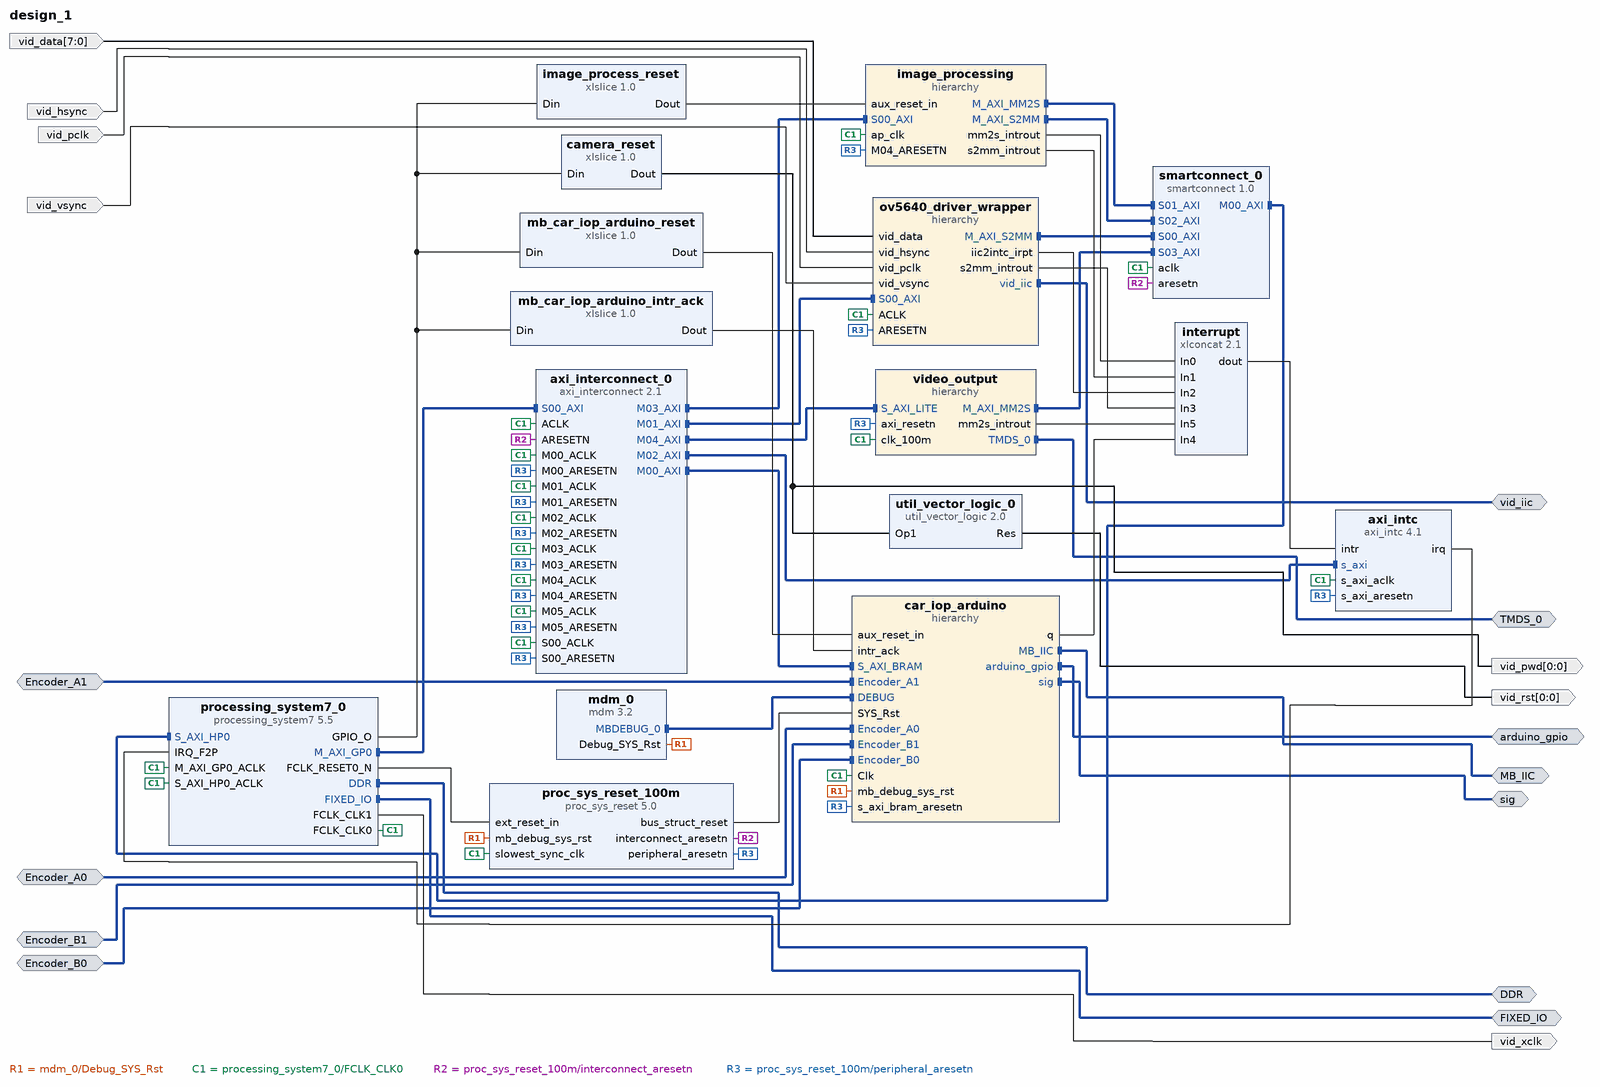
[diagram p0: block diagram of the top level]
# Vivado block design design_1, xc7z020clg400-1, Vivado 2018.3
create_bd_design design_1

create_bd_intf_port -mode Master -vlnv xilinx.com:interface:ddrx_rtl:1.0 DDR
create_bd_intf_port -mode Slave -vlnv xilinx.com:interface:diff_analog_io_rtl:1.0 Encoder_A0
create_bd_intf_port -mode Slave -vlnv xilinx.com:interface:diff_analog_io_rtl:1.0 Encoder_A1
create_bd_intf_port -mode Slave -vlnv xilinx.com:interface:diff_analog_io_rtl:1.0 Encoder_B0
create_bd_intf_port -mode Slave -vlnv xilinx.com:interface:diff_analog_io_rtl:1.0 Encoder_B1
create_bd_intf_port -mode Master -vlnv xilinx.com:display_processing_system7:fixedio_rtl:1.0 FIXED_IO
create_bd_intf_port -mode Master -vlnv xilinx.com:interface:iic_rtl:1.0 MB_IIC
create_bd_intf_port -mode Master -vlnv digilentinc.com:interface:tmds_rtl:1.0 TMDS_0
create_bd_intf_port -mode Master -vlnv xilinx.com:interface:gpio_rtl:1.0 arduino_gpio
create_bd_intf_port -mode Master -vlnv xilinx.com:interface:gpio_rtl:1.0 sig
create_bd_intf_port -mode Master -vlnv xilinx.com:interface:iic_rtl:1.0 vid_iic
create_bd_port -dir I -from 7 -to 0 vid_data
create_bd_port -dir I vid_hsync
create_bd_port -dir I -type clk vid_pclk
set_property -dict {CONFIG.FREQ_HZ 74250000} [get_bd_ports vid_pclk]
create_bd_port -dir O -from 0 -to 0 vid_pwd
create_bd_port -dir O -from 0 -to 0 vid_rst
create_bd_port -dir I vid_vsync
create_bd_port -dir O -type clk vid_xclk
set_property -dict {CONFIG.FREQ_HZ 23809525} [get_bd_ports vid_xclk]

create_bd_cell -type ip -vlnv xilinx.com:ip:axi_intc:4.1 axi_intc
create_bd_cell -type ip -vlnv xilinx.com:ip:axi_interconnect:2.1 axi_interconnect_0
set_property -dict {CONFIG.NUM_MI 6 CONFIG.NUM_SI 1} [get_bd_cells axi_interconnect_0]
create_bd_cell -type ip -vlnv xilinx.com:ip:xlslice:1.0 camera_reset
set_property -dict {CONFIG.DIN_FROM 3 CONFIG.DIN_TO 3 CONFIG.DIN_WIDTH 5 CONFIG.DOUT_WIDTH 1} [get_bd_cells camera_reset]
create_bd_cell -type hier car_iop_arduino
create_bd_cell -type ip -vlnv xilinx.com:ip:xlslice:1.0 image_process_reset
set_property -dict {CONFIG.DIN_FROM 2 CONFIG.DIN_TO 2 CONFIG.DIN_WIDTH 5 CONFIG.DOUT_WIDTH 1} [get_bd_cells image_process_reset]
create_bd_cell -type hier image_processing
create_bd_cell -type ip -vlnv xilinx.com:ip:xlconcat:2.1 interrupt
set_property -dict {CONFIG.NUM_PORTS 7} [get_bd_cells interrupt]
create_bd_cell -type ip -vlnv xilinx.com:ip:xlslice:1.0 mb_car_iop_arduino_intr_ack
set_property -dict [list \
  CONFIG.DIN_FROM 1 \
  CONFIG.DIN_TO 1 \
  CONFIG.DIN_WIDTH 5 \
  CONFIG.DOUT_WIDTH 1 \
] [get_bd_cells mb_car_iop_arduino_intr_ack]
create_bd_cell -type ip -vlnv xilinx.com:ip:xlslice:1.0 mb_car_iop_arduino_reset
set_property -dict {CONFIG.DIN_FROM 0 CONFIG.DIN_TO 0 CONFIG.DIN_WIDTH 5} [get_bd_cells mb_car_iop_arduino_reset]
create_bd_cell -type ip -vlnv xilinx.com:ip:mdm:3.2 mdm_0
set_property -dict {CONFIG.C_ADDR_SIZE 32 CONFIG.C_MB_DBG_PORTS 1 CONFIG.C_M_AXI_ADDR_WIDTH 32} [get_bd_cells mdm_0]
create_bd_cell -type hier ov5640_driver_wrapper
create_bd_cell -type ip -vlnv xilinx.com:ip:proc_sys_reset:5.0 proc_sys_reset_100m
create_bd_cell -type ip -vlnv xilinx.com:ip:processing_system7:5.5 processing_system7_0
set_property -dict [list \
  CONFIG.PCW_APU_PERIPHERAL_FREQMHZ 650 \
  CONFIG.PCW_CRYSTAL_PERIPHERAL_FREQMHZ 50 \
  CONFIG.PCW_ENET0_ENET0_IO {MIO 16 .. 27} \
  CONFIG.PCW_ENET0_GRP_MDIO_ENABLE 1 \
  CONFIG.PCW_ENET0_GRP_MDIO_IO {MIO 52 .. 53} \
  CONFIG.PCW_ENET0_PERIPHERAL_ENABLE 1 \
  CONFIG.PCW_ENET0_RESET_ENABLE 1 \
  CONFIG.PCW_ENET0_RESET_IO {MIO 9} \
  CONFIG.PCW_ENET_RESET_ENABLE 1 \
  CONFIG.PCW_ENET_RESET_SELECT {Share reset pin} \
  CONFIG.PCW_EN_CLK1_PORT 1 \
  CONFIG.PCW_EN_CLK2_PORT 1 \
  CONFIG.PCW_FPGA0_PERIPHERAL_FREQMHZ 100 \
  CONFIG.PCW_FPGA1_PERIPHERAL_FREQMHZ 24 \
  CONFIG.PCW_FPGA2_PERIPHERAL_FREQMHZ 10 \
  CONFIG.PCW_FPGA_FCLK1_ENABLE 1 \
  CONFIG.PCW_FPGA_FCLK2_ENABLE 1 \
  CONFIG.PCW_GPIO_EMIO_GPIO_ENABLE 1 \
  CONFIG.PCW_GPIO_EMIO_GPIO_IO 5 \
  CONFIG.PCW_GPIO_EMIO_GPIO_WIDTH 5 \
  CONFIG.PCW_GPIO_MIO_GPIO_ENABLE 1 \
  CONFIG.PCW_GPIO_MIO_GPIO_IO MIO \
  CONFIG.PCW_I2C_RESET_ENABLE 1 \
  CONFIG.PCW_IRQ_F2P_INTR 1 \
  CONFIG.PCW_PERIPHERAL_BOARD_PRESET part0 \
  CONFIG.PCW_PRESET_BANK1_VOLTAGE {LVCMOS 1.8V} \
  CONFIG.PCW_QSPI_GRP_FBCLK_ENABLE 1 \
  CONFIG.PCW_QSPI_GRP_FBCLK_IO {MIO 8} \
  CONFIG.PCW_QSPI_GRP_SINGLE_SS_ENABLE 1 \
  CONFIG.PCW_QSPI_GRP_SINGLE_SS_IO {MIO 1 .. 6} \
  CONFIG.PCW_QSPI_PERIPHERAL_ENABLE 1 \
  CONFIG.PCW_QSPI_QSPI_IO {MIO 1 .. 6} \
  CONFIG.PCW_SD0_GRP_CD_ENABLE 1 \
  CONFIG.PCW_SD0_GRP_CD_IO {MIO 47} \
  CONFIG.PCW_SD0_GRP_WP_ENABLE 0 \
  CONFIG.PCW_SD0_PERIPHERAL_ENABLE 1 \
  CONFIG.PCW_SD0_SD0_IO {MIO 40 .. 45} \
  CONFIG.PCW_SDIO_PERIPHERAL_FREQMHZ 50 \
  CONFIG.PCW_SINGLE_QSPI_DATA_MODE x4 \
  CONFIG.PCW_UART0_PERIPHERAL_ENABLE 1 \
  CONFIG.PCW_UART0_UART0_IO {MIO 14 .. 15} \
  CONFIG.PCW_UART1_PERIPHERAL_ENABLE 0 \
  CONFIG.PCW_UART_PERIPHERAL_FREQMHZ 100 \
  CONFIG.PCW_UIPARAM_DDR_BUS_WIDTH {16 Bit} \
  CONFIG.PCW_UIPARAM_DDR_FREQ_MHZ 525 \
  CONFIG.PCW_UIPARAM_DDR_PARTNO {MT41J256M16 RE-125} \
  CONFIG.PCW_USB0_PERIPHERAL_ENABLE 1 \
  CONFIG.PCW_USB0_RESET_ENABLE 1 \
  CONFIG.PCW_USB0_RESET_IO {MIO 46} \
  CONFIG.PCW_USB0_USB0_IO {MIO 28 .. 39} \
  CONFIG.PCW_USB_RESET_ENABLE 1 \
  CONFIG.PCW_USB_RESET_SELECT {Share reset pin} \
  CONFIG.PCW_USE_FABRIC_INTERRUPT 1 \
  CONFIG.PCW_USE_S_AXI_HP0 1 \
] [get_bd_cells processing_system7_0]
# 503 more settings of processing_system7_0 are not shown: defaults, MIO pin electricals, DDR timing, and values the tool derives
create_bd_cell -type ip -vlnv xilinx.com:ip:smartconnect:1.0 smartconnect_0
set_property -dict {CONFIG.NUM_SI 4} [get_bd_cells smartconnect_0]
create_bd_cell -type ip -vlnv xilinx.com:ip:util_vector_logic:2.0 util_vector_logic_0
set_property -dict {CONFIG.C_OPERATION not CONFIG.C_SIZE 1} [get_bd_cells util_vector_logic_0]
create_bd_cell -type hier video_output

# ---- hierarchy /car_iop_arduino ----
current_bd_instance /car_iop_arduino
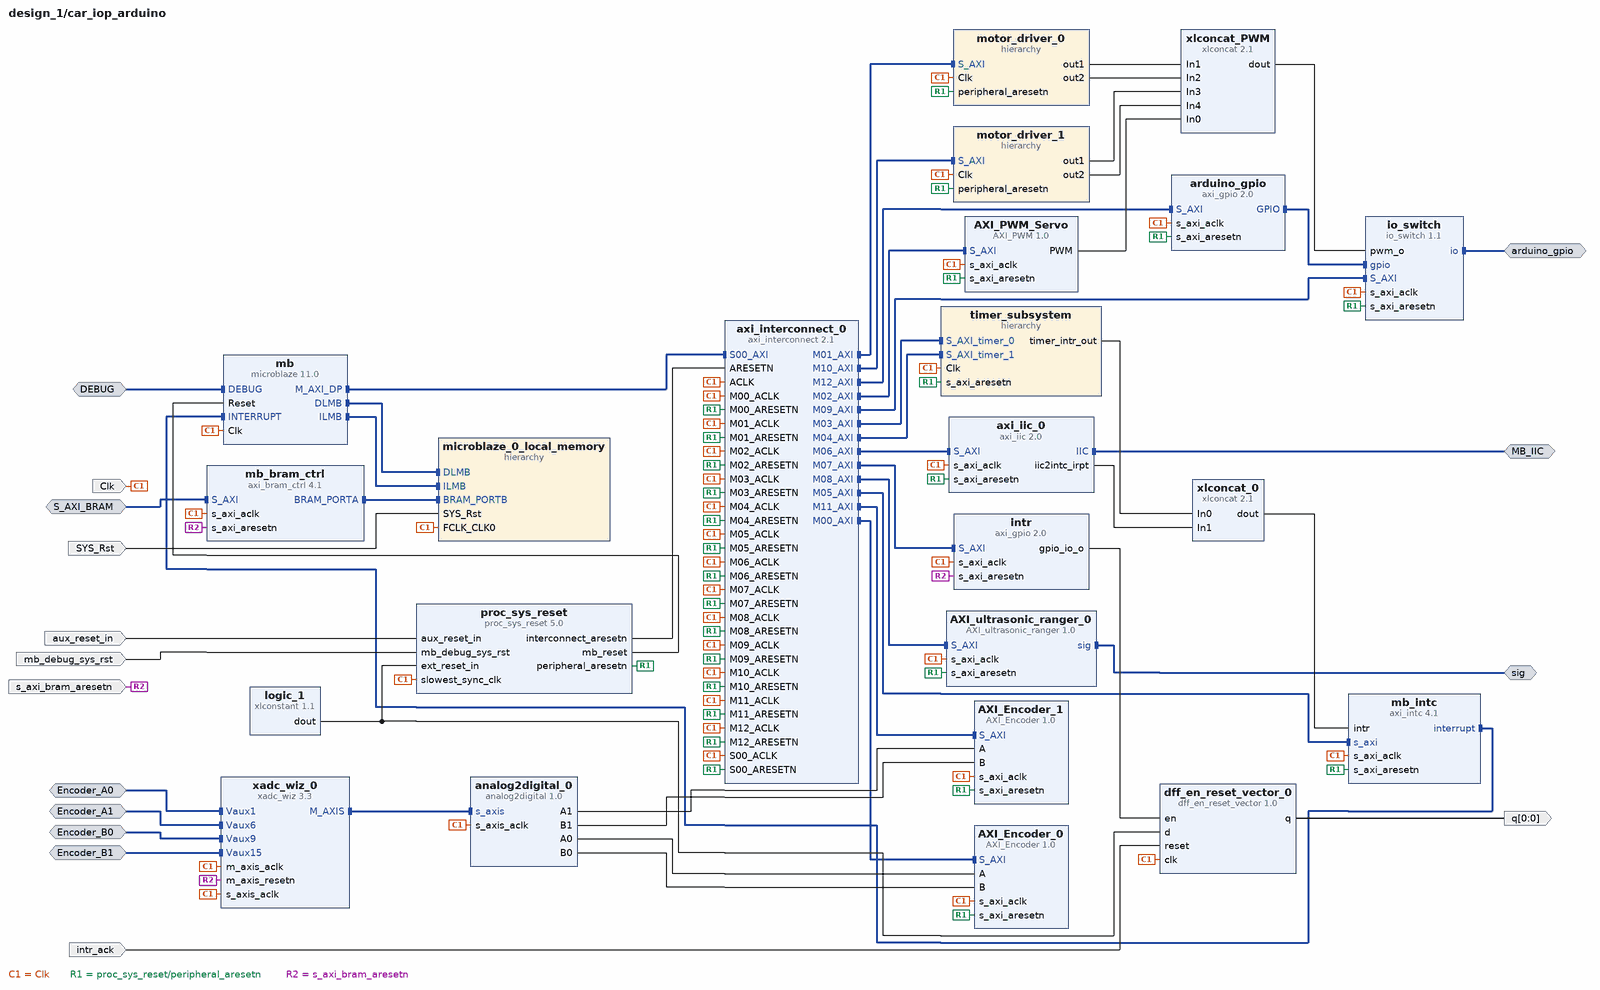
[diagram p1: block diagram inside /car_iop_arduino]
create_bd_intf_pin -mode Slave -vlnv xilinx.com:interface:mbdebug_rtl:3.0 DEBUG
create_bd_intf_pin -mode Slave -vlnv xilinx.com:interface:diff_analog_io_rtl:1.0 Encoder_A0
create_bd_intf_pin -mode Slave -vlnv xilinx.com:interface:diff_analog_io_rtl:1.0 Encoder_A1
create_bd_intf_pin -mode Slave -vlnv xilinx.com:interface:diff_analog_io_rtl:1.0 Encoder_B0
create_bd_intf_pin -mode Slave -vlnv xilinx.com:interface:diff_analog_io_rtl:1.0 Encoder_B1
create_bd_intf_pin -mode Master -vlnv xilinx.com:interface:iic_rtl:1.0 MB_IIC
create_bd_intf_pin -mode Slave -vlnv xilinx.com:interface:aximm_rtl:1.0 S_AXI_BRAM
create_bd_intf_pin -mode Master -vlnv xilinx.com:interface:gpio_rtl:1.0 arduino_gpio
create_bd_intf_pin -mode Master -vlnv xilinx.com:interface:gpio_rtl:1.0 sig
create_bd_pin -dir I -type clk Clk
create_bd_pin -dir I -type rst SYS_Rst
create_bd_pin -dir I -type rst aux_reset_in
create_bd_pin -dir I intr_ack
create_bd_pin -dir I -type rst mb_debug_sys_rst
create_bd_pin -dir O -from 0 -to 0 q
create_bd_pin -dir I -type rst s_axi_bram_aresetn

create_bd_cell -type ip -vlnv xilinx.com:user:AXI_Encoder:1.0 AXI_Encoder_0
create_bd_cell -type ip -vlnv xilinx.com:user:AXI_Encoder:1.0 AXI_Encoder_1
create_bd_cell -type ip -vlnv xilinx.com:user:AXI_PWM:1.0 AXI_PWM_Servo
create_bd_cell -type ip -vlnv xilinx.com:user:AXI_ultrasonic_ranger:1.0 AXI_ultrasonic_ranger_0
set_property -dict {CONFIG.PULSE_WIDTH_US 10} [get_bd_cells AXI_ultrasonic_ranger_0]
create_bd_cell -type ip -vlnv xilinx.com:user:analog2digital:1.0 analog2digital_0
create_bd_cell -type ip -vlnv xilinx.com:ip:axi_gpio:2.0 arduino_gpio
set_property -dict {CONFIG.C_GPIO_WIDTH 15} [get_bd_cells arduino_gpio]
create_bd_cell -type ip -vlnv xilinx.com:ip:axi_iic:2.0 axi_iic_0
create_bd_cell -type ip -vlnv xilinx.com:ip:axi_interconnect:2.1 axi_interconnect_0
set_property -dict {CONFIG.NUM_MI 13} [get_bd_cells axi_interconnect_0]
create_bd_cell -type ip -vlnv xilinx.com:user:dff_en_reset_vector:1.0 dff_en_reset_vector_0
set_property -dict {CONFIG.SIZE 1} [get_bd_cells dff_en_reset_vector_0]
create_bd_cell -type ip -vlnv xilinx.com:ip:axi_gpio:2.0 intr
set_property -dict {CONFIG.C_ALL_OUTPUTS 1 CONFIG.C_GPIO_WIDTH 1} [get_bd_cells intr]
create_bd_cell -type ip -vlnv xilinx.com:user:io_switch:1.1 io_switch
set_property -dict [list \
  CONFIG.C_INTERFACE_TYPE 3 \
  CONFIG.C_IO_SWITCH_WIDTH 13 \
  CONFIG.C_NUM_PWMS 5 \
  CONFIG.I2C0_Enable false \
  CONFIG.PWM_Enable true \
] [get_bd_cells io_switch]
create_bd_cell -type ip -vlnv xilinx.com:ip:xlconstant:1.1 logic_1
create_bd_cell -type ip -vlnv xilinx.com:ip:microblaze:11.0 mb
set_property -dict [list \
  CONFIG.C_ADDR_TAG_BITS 0 \
  CONFIG.C_DCACHE_ADDR_TAG 0 \
  CONFIG.C_DEBUG_ENABLED 1 \
  CONFIG.C_D_AXI 1 \
  CONFIG.C_D_LMB 1 \
  CONFIG.C_ENABLE_DISCRETE_PORTS 0 \
  CONFIG.C_I_AXI 0 \
  CONFIG.C_I_LMB 1 \
  CONFIG.C_USE_BARREL 0 \
  CONFIG.C_USE_DCACHE 0 \
  CONFIG.C_USE_DIV 1 \
  CONFIG.C_USE_FPU 1 \
  CONFIG.C_USE_HW_MUL 1 \
  CONFIG.C_USE_ICACHE 0 \
  CONFIG.C_USE_MMU 0 \
  CONFIG.G_USE_EXCEPTIONS 0 \
] [get_bd_cells mb]
create_bd_cell -type ip -vlnv xilinx.com:ip:axi_bram_ctrl:4.1 mb_bram_ctrl
set_property -dict {CONFIG.PROTOCOL AXI4 CONFIG.SINGLE_PORT_BRAM 1} [get_bd_cells mb_bram_ctrl]
create_bd_cell -type ip -vlnv xilinx.com:ip:axi_intc:4.1 mb_intc
create_bd_cell -type hier microblaze_0_local_memory
create_bd_cell -type hier motor_driver_0
create_bd_cell -type hier motor_driver_1
create_bd_cell -type ip -vlnv xilinx.com:ip:proc_sys_reset:5.0 proc_sys_reset
set_property -dict {CONFIG.C_AUX_RESET_HIGH 1} [get_bd_cells proc_sys_reset]
create_bd_cell -type hier timer_subsystem
create_bd_cell -type ip -vlnv xilinx.com:ip:xadc_wiz:3.3 xadc_wiz_0
set_property -dict [list \
  CONFIG.CHANNEL_ENABLE_VAUXP15_VAUXN15 true \
  CONFIG.CHANNEL_ENABLE_VAUXP1_VAUXN1 true \
  CONFIG.CHANNEL_ENABLE_VAUXP2_VAUXN2 false \
  CONFIG.CHANNEL_ENABLE_VAUXP5_VAUXN5 false \
  CONFIG.CHANNEL_ENABLE_VAUXP6_VAUXN6 true \
  CONFIG.CHANNEL_ENABLE_VAUXP9_VAUXN9 true \
  CONFIG.CHANNEL_ENABLE_VP_VN false \
  CONFIG.ENABLE_AXI4STREAM true \
  CONFIG.ENABLE_RESET false \
  CONFIG.ENABLE_VCCDDRO_ALARM false \
  CONFIG.ENABLE_VCCPAUX_ALARM false \
  CONFIG.ENABLE_VCCPINT_ALARM false \
  CONFIG.EXTERNAL_MUX_CHANNEL VP_VN \
  CONFIG.FIFO_DEPTH 16 \
  CONFIG.INTERFACE_SELECTION None \
  CONFIG.OT_ALARM false \
  CONFIG.SEQUENCER_MODE Continuous \
  CONFIG.SINGLE_CHANNEL_SELECTION TEMPERATURE \
  CONFIG.USER_TEMP_ALARM false \
  CONFIG.VCCAUX_ALARM false \
  CONFIG.VCCINT_ALARM false \
  CONFIG.XADC_STARUP_SELECTION channel_sequencer \
] [get_bd_cells xadc_wiz_0]
create_bd_cell -type ip -vlnv xilinx.com:ip:xlconcat:2.1 xlconcat_0
create_bd_cell -type ip -vlnv xilinx.com:ip:xlconcat:2.1 xlconcat_PWM
set_property -dict {CONFIG.NUM_PORTS 5} [get_bd_cells xlconcat_PWM]

# ---- hierarchy /car_iop_arduino/microblaze_0_local_memory ----
current_bd_instance /car_iop_arduino/microblaze_0_local_memory
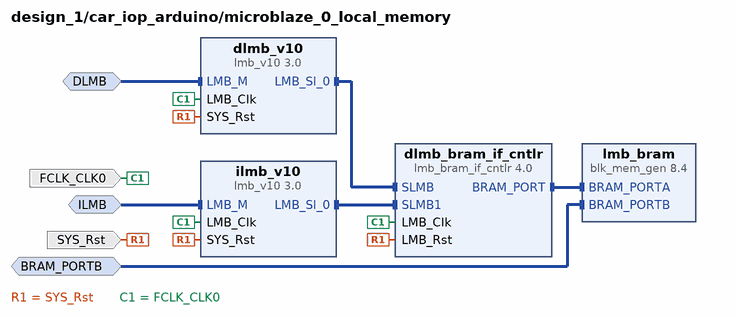
[diagram p2: block diagram inside /car_iop_arduino/microblaze_0_local_memory]
create_bd_intf_pin -mode Slave -vlnv xilinx.com:interface:bram_rtl:1.0 BRAM_PORTB
create_bd_intf_pin -mode MirroredMaster -vlnv xilinx.com:interface:lmb_rtl:1.0 DLMB
create_bd_intf_pin -mode MirroredMaster -vlnv xilinx.com:interface:lmb_rtl:1.0 ILMB
create_bd_pin -dir I -type clk FCLK_CLK0
create_bd_pin -dir I -type rst SYS_Rst

create_bd_cell -type ip -vlnv xilinx.com:ip:lmb_bram_if_cntlr:4.0 dlmb_bram_if_cntlr
set_property -dict {CONFIG.C_ECC 0 CONFIG.C_NUM_LMB 2} [get_bd_cells dlmb_bram_if_cntlr]
create_bd_cell -type ip -vlnv xilinx.com:ip:lmb_v10:3.0 dlmb_v10
create_bd_cell -type ip -vlnv xilinx.com:ip:lmb_v10:3.0 ilmb_v10
create_bd_cell -type ip -vlnv xilinx.com:ip:blk_mem_gen:8.4 lmb_bram
set_property -dict {CONFIG.Memory_Type True_Dual_Port_RAM CONFIG.use_bram_block BRAM_Controller} [get_bd_cells lmb_bram]

# ---- hierarchy /car_iop_arduino/motor_driver_0 ----
current_bd_instance /car_iop_arduino/motor_driver_0
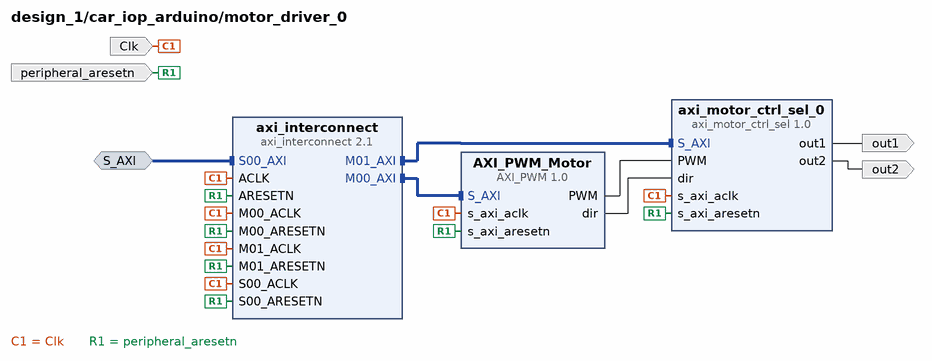
[diagram p3: block diagram inside /car_iop_arduino/motor_driver_0]
create_bd_intf_pin -mode Slave -vlnv xilinx.com:interface:aximm_rtl:1.0 S_AXI
create_bd_pin -dir I -type clk Clk
create_bd_pin -dir O out1
create_bd_pin -dir O out2
create_bd_pin -dir I -type rst peripheral_aresetn

create_bd_cell -type ip -vlnv xilinx.com:user:AXI_PWM:1.0 AXI_PWM_Motor
create_bd_cell -type ip -vlnv xilinx.com:ip:axi_interconnect:2.1 axi_interconnect
create_bd_cell -type ip -vlnv xilinx.com:user:axi_motor_ctrl_sel:1.0 axi_motor_ctrl_sel_0

# ---- hierarchy /car_iop_arduino/motor_driver_1 ----
current_bd_instance /car_iop_arduino/motor_driver_1
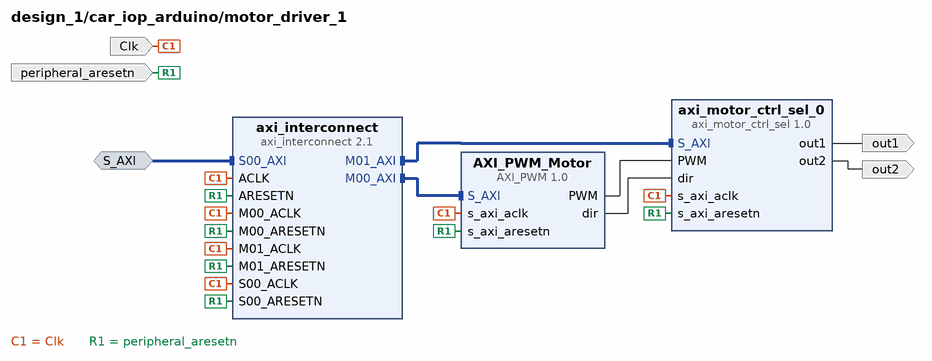
[diagram p4: block diagram inside /car_iop_arduino/motor_driver_1]
create_bd_intf_pin -mode Slave -vlnv xilinx.com:interface:aximm_rtl:1.0 S_AXI
create_bd_pin -dir I -type clk Clk
create_bd_pin -dir O out1
create_bd_pin -dir O out2
create_bd_pin -dir I -type rst peripheral_aresetn

create_bd_cell -type ip -vlnv xilinx.com:user:AXI_PWM:1.0 AXI_PWM_Motor
create_bd_cell -type ip -vlnv xilinx.com:ip:axi_interconnect:2.1 axi_interconnect
create_bd_cell -type ip -vlnv xilinx.com:user:axi_motor_ctrl_sel:1.0 axi_motor_ctrl_sel_0

# ---- hierarchy /car_iop_arduino/timer_subsystem ----
current_bd_instance /car_iop_arduino/timer_subsystem
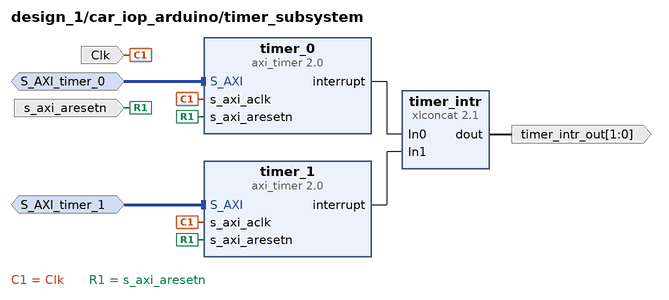
[diagram p5: block diagram inside /car_iop_arduino/timer_subsystem]
create_bd_intf_pin -mode Slave -vlnv xilinx.com:interface:aximm_rtl:1.0 S_AXI_timer_0
create_bd_intf_pin -mode Slave -vlnv xilinx.com:interface:aximm_rtl:1.0 S_AXI_timer_1
create_bd_pin -dir I -type clk Clk
create_bd_pin -dir I -type rst s_axi_aresetn
create_bd_pin -dir O -from 1 -to 0 timer_intr_out

create_bd_cell -type ip -vlnv xilinx.com:ip:axi_timer:2.0 timer_0
create_bd_cell -type ip -vlnv xilinx.com:ip:axi_timer:2.0 timer_1
create_bd_cell -type ip -vlnv xilinx.com:ip:xlconcat:2.1 timer_intr
set_property -dict {CONFIG.NUM_PORTS 2} [get_bd_cells timer_intr]

# ---- hierarchy /image_processing ----
current_bd_instance /image_processing
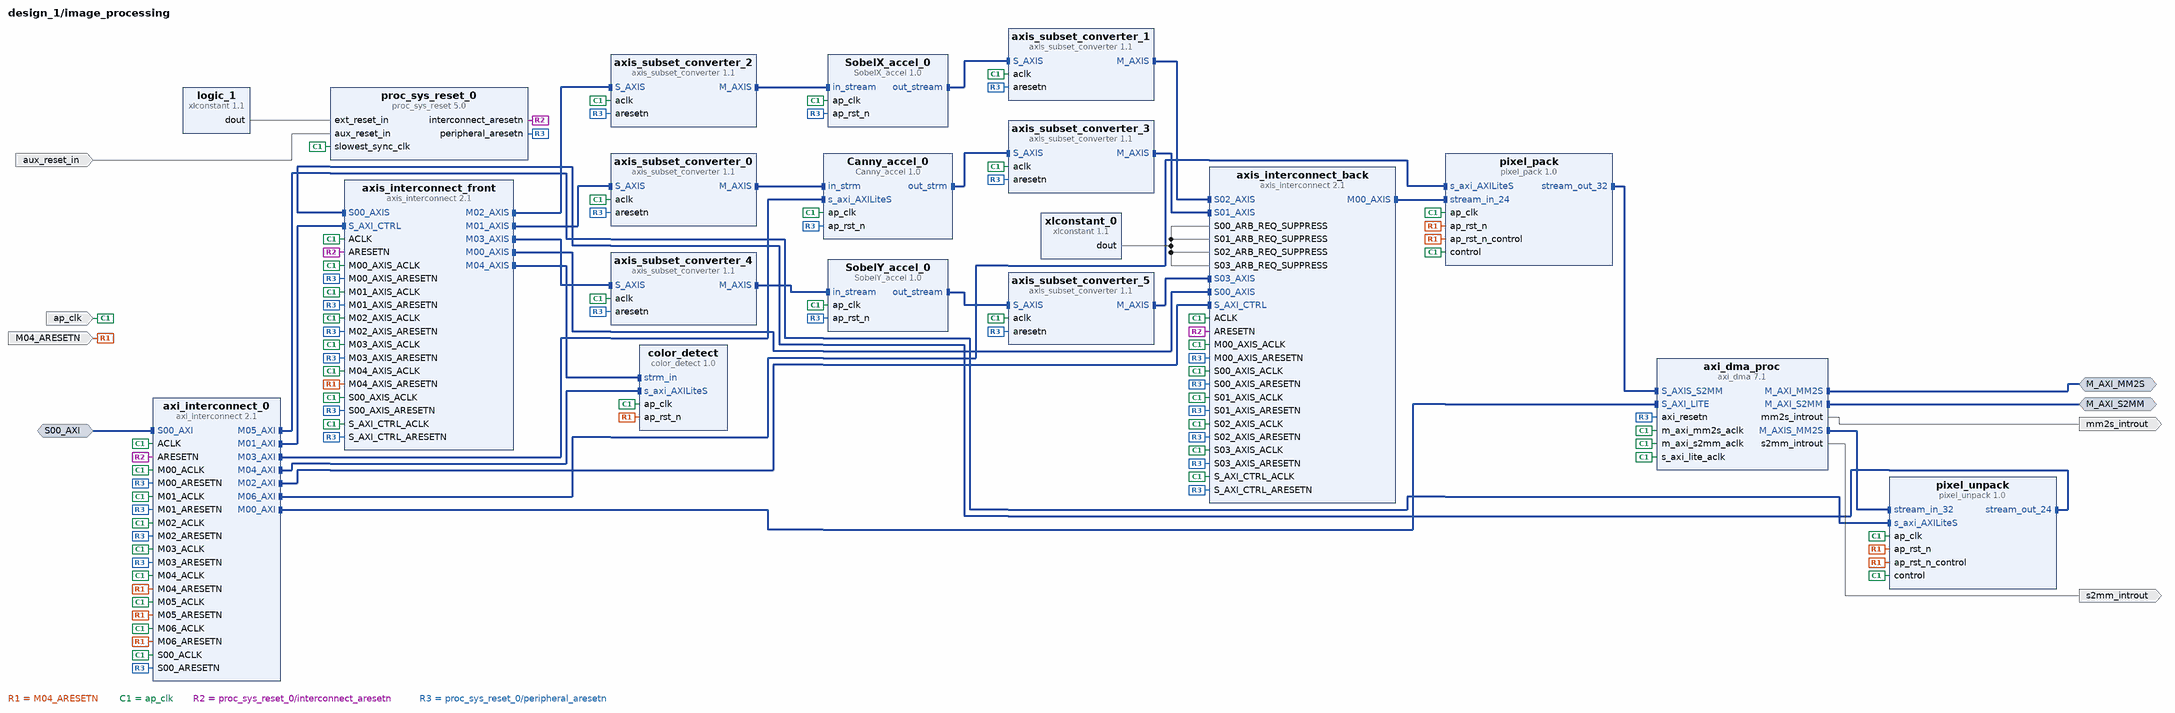
[diagram p6: block diagram inside /image_processing]
create_bd_intf_pin -mode Master -vlnv xilinx.com:interface:aximm_rtl:1.0 M_AXI_MM2S
create_bd_intf_pin -mode Master -vlnv xilinx.com:interface:aximm_rtl:1.0 M_AXI_S2MM
create_bd_intf_pin -mode Slave -vlnv xilinx.com:interface:aximm_rtl:1.0 S00_AXI
create_bd_pin -dir I -type rst M04_ARESETN
create_bd_pin -dir I -type clk ap_clk
create_bd_pin -dir I -type rst aux_reset_in
create_bd_pin -dir O -type intr mm2s_introut
create_bd_pin -dir O -type intr s2mm_introut

create_bd_cell -type ip -vlnv xilinx.com:hls:Canny_accel:1.0 Canny_accel_0
create_bd_cell -type ip -vlnv xilinx.com:hls:SobelX_accel:1.0 SobelX_accel_0
create_bd_cell -type ip -vlnv xilinx.com:hls:SobelY_accel:1.0 SobelY_accel_0
create_bd_cell -type ip -vlnv xilinx.com:ip:axi_dma:7.1 axi_dma_proc
set_property -dict [list \
  CONFIG.c_include_sg 0 \
  CONFIG.c_m_axi_mm2s_data_width 32 \
  CONFIG.c_mm2s_burst_size 16 \
  CONFIG.c_sg_length_width 26 \
] [get_bd_cells axi_dma_proc]
create_bd_cell -type ip -vlnv xilinx.com:ip:axi_interconnect:2.1 axi_interconnect_0
set_property -dict {CONFIG.NUM_MI 7} [get_bd_cells axi_interconnect_0]
create_bd_cell -type ip -vlnv xilinx.com:ip:axis_interconnect:2.1 axis_interconnect_back
set_property -dict {CONFIG.NUM_MI 1 CONFIG.NUM_SI 4 CONFIG.ROUTING_MODE 1} [get_bd_cells axis_interconnect_back]
create_bd_cell -type ip -vlnv xilinx.com:ip:axis_interconnect:2.1 axis_interconnect_front
set_property -dict {CONFIG.NUM_MI 5 CONFIG.ROUTING_MODE 1} [get_bd_cells axis_interconnect_front]
create_bd_cell -type ip -vlnv xilinx.com:ip:axis_subset_converter:1.1 axis_subset_converter_0
set_property -dict [list \
  CONFIG.M_HAS_TKEEP 1 \
  CONFIG.M_HAS_TLAST 1 \
  CONFIG.M_HAS_TREADY 1 \
  CONFIG.M_HAS_TSTRB 0 \
  CONFIG.M_TDATA_NUM_BYTES 1 \
  CONFIG.M_TDEST_WIDTH 0 \
  CONFIG.M_TID_WIDTH 0 \
  CONFIG.M_TUSER_WIDTH 0 \
  CONFIG.S_HAS_TKEEP 1 \
  CONFIG.S_HAS_TLAST 1 \
  CONFIG.S_HAS_TREADY 1 \
  CONFIG.S_HAS_TSTRB 0 \
  CONFIG.S_TDATA_NUM_BYTES 3 \
  CONFIG.S_TDEST_WIDTH 0 \
  CONFIG.S_TID_WIDTH 0 \
  CONFIG.S_TUSER_WIDTH 0 \
  CONFIG.TDATA_REMAP {tdata[7:0]} \
  CONFIG.TDEST_REMAP {1'b0} \
  CONFIG.TID_REMAP {1'b0} \
  CONFIG.TKEEP_REMAP {tkeep[0:0]} \
  CONFIG.TSTRB_REMAP {1'b0} \
  CONFIG.TUSER_REMAP {1'b0} \
] [get_bd_cells axis_subset_converter_0]
create_bd_cell -type ip -vlnv xilinx.com:ip:axis_subset_converter:1.1 axis_subset_converter_1
set_property -dict [list \
  CONFIG.M_HAS_TKEEP 1 \
  CONFIG.M_HAS_TLAST 1 \
  CONFIG.M_HAS_TREADY 1 \
  CONFIG.M_HAS_TSTRB 0 \
  CONFIG.M_TDATA_NUM_BYTES 3 \
  CONFIG.M_TDEST_WIDTH 0 \
  CONFIG.M_TID_WIDTH 0 \
  CONFIG.M_TUSER_WIDTH 0 \
  CONFIG.S_HAS_TKEEP 1 \
  CONFIG.S_HAS_TLAST 1 \
  CONFIG.S_HAS_TREADY 1 \
  CONFIG.S_HAS_TSTRB 0 \
  CONFIG.S_TDATA_NUM_BYTES 1 \
  CONFIG.S_TDEST_WIDTH 0 \
  CONFIG.S_TID_WIDTH 0 \
  CONFIG.S_TUSER_WIDTH 0 \
  CONFIG.TDATA_REMAP {16'b0000000000000000,tdata[7:0]} \
  CONFIG.TDEST_REMAP {1'b0} \
  CONFIG.TID_REMAP {1'b0} \
  CONFIG.TKEEP_REMAP {2'b11,tkeep[0:0]} \
  CONFIG.TSTRB_REMAP {1'b0} \
  CONFIG.TUSER_REMAP {1'b0} \
] [get_bd_cells axis_subset_converter_1]
create_bd_cell -type ip -vlnv xilinx.com:ip:axis_subset_converter:1.1 axis_subset_converter_2
set_property -dict [list \
  CONFIG.M_HAS_TKEEP 1 \
  CONFIG.M_HAS_TLAST 1 \
  CONFIG.M_HAS_TREADY 1 \
  CONFIG.M_HAS_TSTRB 0 \
  CONFIG.M_TDATA_NUM_BYTES 1 \
  CONFIG.M_TDEST_WIDTH 0 \
  CONFIG.M_TID_WIDTH 0 \
  CONFIG.M_TUSER_WIDTH 0 \
  CONFIG.S_HAS_TKEEP 1 \
  CONFIG.S_HAS_TLAST 1 \
  CONFIG.S_HAS_TREADY 1 \
  CONFIG.S_HAS_TSTRB 0 \
  CONFIG.S_TDATA_NUM_BYTES 3 \
  CONFIG.S_TDEST_WIDTH 0 \
  CONFIG.S_TID_WIDTH 0 \
  CONFIG.S_TUSER_WIDTH 0 \
  CONFIG.TDATA_REMAP {tdata[7:0]} \
  CONFIG.TDEST_REMAP {1'b0} \
  CONFIG.TID_REMAP {1'b0} \
  CONFIG.TKEEP_REMAP {tkeep[0:0]} \
  CONFIG.TSTRB_REMAP {1'b0} \
  CONFIG.TUSER_REMAP {1'b0} \
] [get_bd_cells axis_subset_converter_2]
create_bd_cell -type ip -vlnv xilinx.com:ip:axis_subset_converter:1.1 axis_subset_converter_3
set_property -dict [list \
  CONFIG.M_HAS_TKEEP 1 \
  CONFIG.M_HAS_TLAST 1 \
  CONFIG.M_HAS_TREADY 1 \
  CONFIG.M_HAS_TSTRB 0 \
  CONFIG.M_TDATA_NUM_BYTES 3 \
  CONFIG.M_TDEST_WIDTH 0 \
  CONFIG.M_TID_WIDTH 0 \
  CONFIG.M_TUSER_WIDTH 0 \
  CONFIG.S_HAS_TKEEP 1 \
  CONFIG.S_HAS_TLAST 1 \
  CONFIG.S_HAS_TREADY 1 \
  CONFIG.S_HAS_TSTRB 0 \
  CONFIG.S_TDATA_NUM_BYTES 1 \
  CONFIG.S_TDEST_WIDTH 0 \
  CONFIG.S_TID_WIDTH 0 \
  CONFIG.S_TUSER_WIDTH 0 \
  CONFIG.TDATA_REMAP {16'b0000000000000000,tdata[7:0]} \
  CONFIG.TDEST_REMAP {1'b0} \
  CONFIG.TID_REMAP {1'b0} \
  CONFIG.TKEEP_REMAP {2'b11,tkeep[0:0]} \
  CONFIG.TSTRB_REMAP {1'b0} \
  CONFIG.TUSER_REMAP {1'b0} \
] [get_bd_cells axis_subset_converter_3]
create_bd_cell -type ip -vlnv xilinx.com:ip:axis_subset_converter:1.1 axis_subset_converter_4
set_property -dict [list \
  CONFIG.M_HAS_TKEEP 1 \
  CONFIG.M_HAS_TLAST 1 \
  CONFIG.M_HAS_TREADY 1 \
  CONFIG.M_HAS_TSTRB 0 \
  CONFIG.M_TDATA_NUM_BYTES 1 \
  CONFIG.M_TDEST_WIDTH 0 \
  CONFIG.M_TID_WIDTH 0 \
  CONFIG.M_TUSER_WIDTH 0 \
  CONFIG.S_HAS_TKEEP 1 \
  CONFIG.S_HAS_TLAST 1 \
  CONFIG.S_HAS_TREADY 1 \
  CONFIG.S_HAS_TSTRB 0 \
  CONFIG.S_TDATA_NUM_BYTES 3 \
  CONFIG.S_TDEST_WIDTH 0 \
  CONFIG.S_TID_WIDTH 0 \
  CONFIG.S_TUSER_WIDTH 0 \
  CONFIG.TDATA_REMAP {tdata[7:0]} \
  CONFIG.TDEST_REMAP {1'b0} \
  CONFIG.TID_REMAP {1'b0} \
  CONFIG.TKEEP_REMAP {tkeep[0:0]} \
  CONFIG.TSTRB_REMAP {1'b0} \
  CONFIG.TUSER_REMAP {1'b0} \
] [get_bd_cells axis_subset_converter_4]
create_bd_cell -type ip -vlnv xilinx.com:ip:axis_subset_converter:1.1 axis_subset_converter_5
set_property -dict [list \
  CONFIG.M_HAS_TKEEP 1 \
  CONFIG.M_HAS_TLAST 1 \
  CONFIG.M_HAS_TREADY 1 \
  CONFIG.M_HAS_TSTRB 0 \
  CONFIG.M_TDATA_NUM_BYTES 3 \
  CONFIG.M_TDEST_WIDTH 0 \
  CONFIG.M_TID_WIDTH 0 \
  CONFIG.M_TUSER_WIDTH 0 \
  CONFIG.S_HAS_TKEEP 1 \
  CONFIG.S_HAS_TLAST 1 \
  CONFIG.S_HAS_TREADY 1 \
  CONFIG.S_HAS_TSTRB 0 \
  CONFIG.S_TDATA_NUM_BYTES 1 \
  CONFIG.S_TDEST_WIDTH 0 \
  CONFIG.S_TID_WIDTH 0 \
  CONFIG.S_TUSER_WIDTH 0 \
  CONFIG.TDATA_REMAP {16'b0000000000000000,tdata[7:0]} \
  CONFIG.TDEST_REMAP {1'b0} \
  CONFIG.TID_REMAP {1'b0} \
  CONFIG.TKEEP_REMAP {2'b11,tkeep[0:0]} \
  CONFIG.TSTRB_REMAP {1'b0} \
  CONFIG.TUSER_REMAP {1'b0} \
] [get_bd_cells axis_subset_converter_5]
create_bd_cell -type ip -vlnv xilinx.com:hls:color_detect:1.0 color_detect
create_bd_cell -type ip -vlnv xilinx.com:ip:xlconstant:1.1 logic_1
create_bd_cell -type ip -vlnv xilinx.com:hls:pixel_pack:1.0 pixel_pack
create_bd_cell -type ip -vlnv xilinx.com:hls:pixel_unpack:1.0 pixel_unpack
create_bd_cell -type ip -vlnv xilinx.com:ip:proc_sys_reset:5.0 proc_sys_reset_0
set_property -dict {CONFIG.C_AUX_RESET_HIGH 1} [get_bd_cells proc_sys_reset_0]
create_bd_cell -type ip -vlnv xilinx.com:ip:xlconstant:1.1 xlconstant_0
set_property -dict {CONFIG.CONST_VAL 0} [get_bd_cells xlconstant_0]

# ---- hierarchy /ov5640_driver_wrapper ----
current_bd_instance /ov5640_driver_wrapper
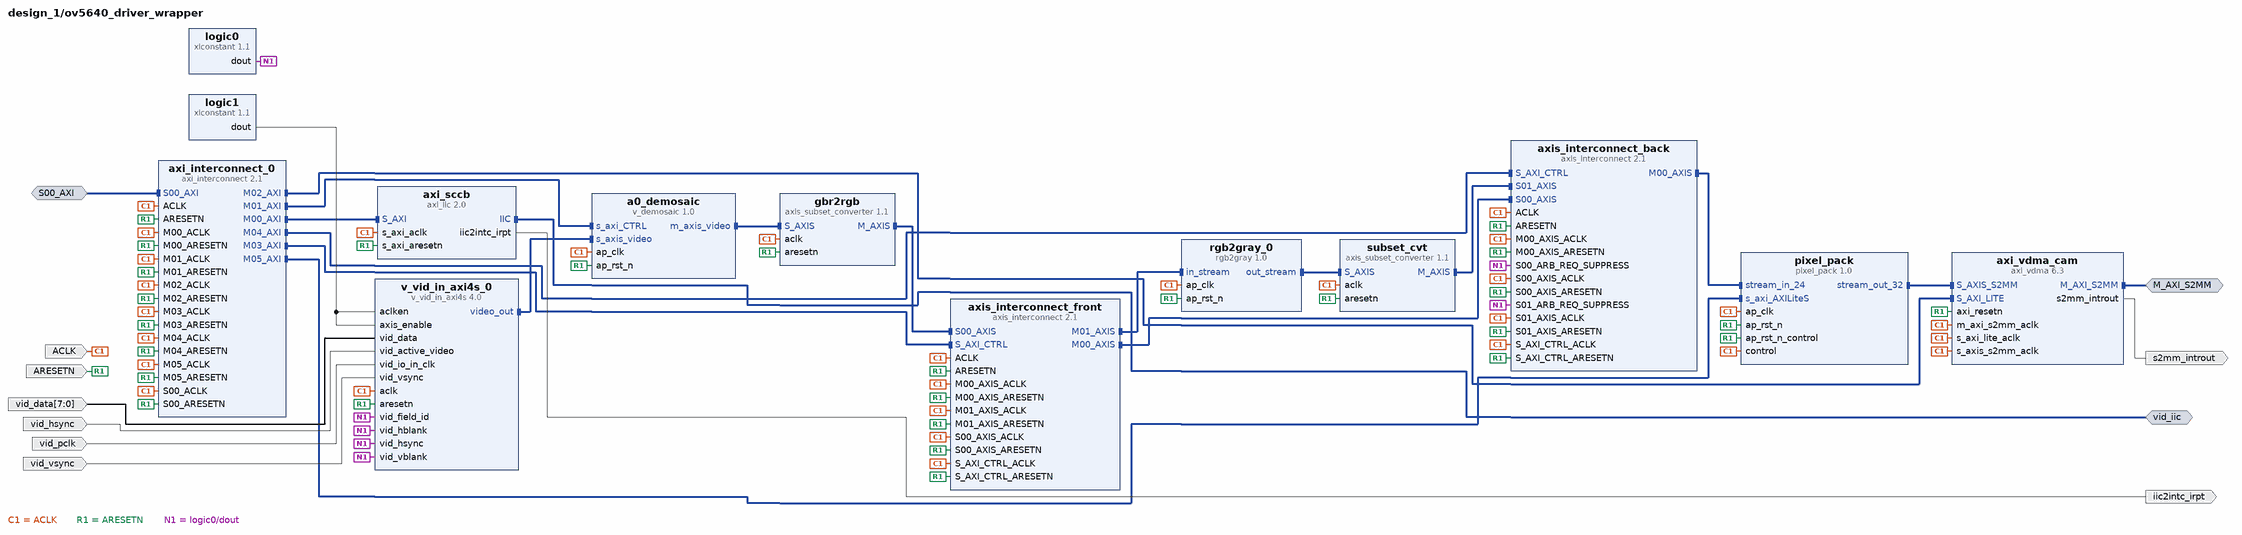
[diagram p7: block diagram inside /ov5640_driver_wrapper]
create_bd_intf_pin -mode Master -vlnv xilinx.com:interface:aximm_rtl:1.0 M_AXI_S2MM
create_bd_intf_pin -mode Slave -vlnv xilinx.com:interface:aximm_rtl:1.0 S00_AXI
create_bd_intf_pin -mode Master -vlnv xilinx.com:interface:iic_rtl:1.0 vid_iic
create_bd_pin -dir I -type clk ACLK
create_bd_pin -dir I -type rst ARESETN
create_bd_pin -dir O -type intr iic2intc_irpt
create_bd_pin -dir O -type intr s2mm_introut
create_bd_pin -dir I -from 7 -to 0 vid_data
create_bd_pin -dir I vid_hsync
create_bd_pin -dir I -type clk vid_pclk
create_bd_pin -dir I vid_vsync

create_bd_cell -type ip -vlnv xilinx.com:ip:v_demosaic:1.0 a0_demosaic
create_bd_cell -type ip -vlnv xilinx.com:ip:axi_interconnect:2.1 axi_interconnect_0
set_property -dict {CONFIG.NUM_MI 6} [get_bd_cells axi_interconnect_0]
create_bd_cell -type ip -vlnv xilinx.com:ip:axi_iic:2.0 axi_sccb
create_bd_cell -type ip -vlnv xilinx.com:ip:axi_vdma:6.3 axi_vdma_cam
set_property -dict [list \
  CONFIG.c_include_mm2s 0 \
  CONFIG.c_num_fstores 4 \
  CONFIG.c_s2mm_genlock_mode 0 \
  CONFIG.c_s2mm_linebuffer_depth 1024 \
] [get_bd_cells axi_vdma_cam]
create_bd_cell -type ip -vlnv xilinx.com:ip:axis_interconnect:2.1 axis_interconnect_back
set_property -dict {CONFIG.NUM_MI 1 CONFIG.NUM_SI 2 CONFIG.ROUTING_MODE 1} [get_bd_cells axis_interconnect_back]
create_bd_cell -type ip -vlnv xilinx.com:ip:axis_interconnect:2.1 axis_interconnect_front
set_property -dict {CONFIG.ROUTING_MODE 1} [get_bd_cells axis_interconnect_front]
create_bd_cell -type ip -vlnv xilinx.com:ip:axis_subset_converter:1.1 gbr2rgb
set_property -dict [list \
  CONFIG.M_HAS_TKEEP 1 \
  CONFIG.M_HAS_TLAST 1 \
  CONFIG.M_HAS_TREADY 1 \
  CONFIG.M_HAS_TSTRB 0 \
  CONFIG.M_TDATA_NUM_BYTES 3 \
  CONFIG.M_TDEST_WIDTH 0 \
  CONFIG.M_TID_WIDTH 0 \
  CONFIG.M_TUSER_WIDTH 1 \
  CONFIG.S_HAS_TKEEP 1 \
  CONFIG.S_HAS_TLAST 1 \
  CONFIG.S_HAS_TREADY 1 \
  CONFIG.S_HAS_TSTRB 0 \
  CONFIG.S_TDATA_NUM_BYTES 3 \
  CONFIG.S_TDEST_WIDTH 0 \
  CONFIG.S_TID_WIDTH 0 \
  CONFIG.S_TUSER_WIDTH 1 \
  CONFIG.TDATA_REMAP {tdata[15:8],tdata[7:0],tdata[23:16]} \
  CONFIG.TDEST_REMAP {1'b0} \
  CONFIG.TID_REMAP {1'b0} \
  CONFIG.TKEEP_REMAP {tkeep[2:0]} \
  CONFIG.TSTRB_REMAP {1'b0} \
] [get_bd_cells gbr2rgb]
create_bd_cell -type ip -vlnv xilinx.com:ip:xlconstant:1.1 logic0
set_property -dict {CONFIG.CONST_VAL 0} [get_bd_cells logic0]
create_bd_cell -type ip -vlnv xilinx.com:ip:xlconstant:1.1 logic1
create_bd_cell -type ip -vlnv xilinx.com:hls:pixel_pack:1.0 pixel_pack
create_bd_cell -type ip -vlnv xilinx.com:hls:rgb2gray:1.0 rgb2gray_0
create_bd_cell -type ip -vlnv xilinx.com:ip:axis_subset_converter:1.1 subset_cvt
set_property -dict [list \
  CONFIG.M_HAS_TKEEP 1 \
  CONFIG.M_HAS_TLAST 1 \
  CONFIG.M_HAS_TREADY 1 \
  CONFIG.M_HAS_TSTRB 0 \
  CONFIG.M_TDATA_NUM_BYTES 3 \
  CONFIG.M_TDEST_WIDTH 0 \
  CONFIG.M_TID_WIDTH 0 \
  CONFIG.M_TUSER_WIDTH 1 \
  CONFIG.S_HAS_TKEEP 1 \
  CONFIG.S_HAS_TLAST 1 \
  CONFIG.S_HAS_TREADY 1 \
  CONFIG.S_HAS_TSTRB 0 \
  CONFIG.S_TDATA_NUM_BYTES 1 \
  CONFIG.S_TDEST_WIDTH 0 \
  CONFIG.S_TID_WIDTH 0 \
  CONFIG.S_TUSER_WIDTH 1 \
  CONFIG.TDATA_REMAP {16'b0000000000000000,tdata[7:0]} \
  CONFIG.TDEST_REMAP {1'b0} \
  CONFIG.TID_REMAP {1'b0} \
  CONFIG.TKEEP_REMAP {2'b11,tkeep[0:0]} \
  CONFIG.TSTRB_REMAP {1'b0} \
] [get_bd_cells subset_cvt]
create_bd_cell -type ip -vlnv xilinx.com:ip:v_vid_in_axi4s:4.0 v_vid_in_axi4s_0
set_property -dict [list \
  CONFIG.C_ADDR_WIDTH 11 \
  CONFIG.C_HAS_ASYNC_CLK 1 \
  CONFIG.C_M_AXIS_VIDEO_FORMAT 12 \
] [get_bd_cells v_vid_in_axi4s_0]

# ---- hierarchy /video_output ----
current_bd_instance /video_output
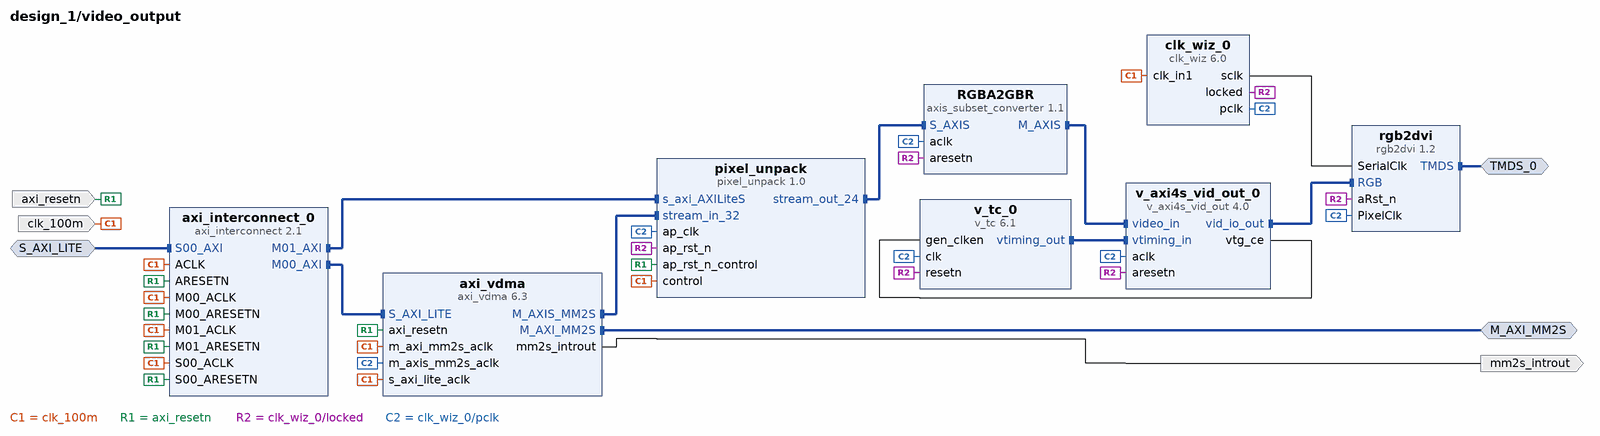
[diagram p8: block diagram inside /video_output]
create_bd_intf_pin -mode Master -vlnv xilinx.com:interface:aximm_rtl:1.0 M_AXI_MM2S
create_bd_intf_pin -mode Slave -vlnv xilinx.com:interface:aximm_rtl:1.0 S_AXI_LITE
create_bd_intf_pin -mode Master -vlnv digilentinc.com:interface:tmds_rtl:1.0 TMDS_0
create_bd_pin -dir I -type rst axi_resetn
create_bd_pin -dir I -type clk clk_100m
create_bd_pin -dir O -type intr mm2s_introut

create_bd_cell -type ip -vlnv xilinx.com:ip:axis_subset_converter:1.1 RGBA2GBR
set_property -dict [list \
  CONFIG.M_TDATA_NUM_BYTES 3 \
  CONFIG.S_TDATA_NUM_BYTES 3 \
  CONFIG.TDATA_REMAP {tdata[7:0],tdata[23:8]} \
] [get_bd_cells RGBA2GBR]
create_bd_cell -type ip -vlnv xilinx.com:ip:axi_interconnect:2.1 axi_interconnect_0
create_bd_cell -type ip -vlnv xilinx.com:ip:axi_vdma:6.3 axi_vdma
set_property -dict [list \
  CONFIG.c_include_s2mm 0 \
  CONFIG.c_m_axi_mm2s_data_width 32 \
  CONFIG.c_m_axis_mm2s_tdata_width 32 \
  CONFIG.c_mm2s_genlock_mode 1 \
  CONFIG.c_mm2s_max_burst_length 16 \
  CONFIG.c_num_fstores 4 \
] [get_bd_cells axi_vdma]
create_bd_cell -type ip -vlnv xilinx.com:ip:clk_wiz:6.0 clk_wiz_0
set_property -dict [list \
  CONFIG.CLKOUT1_DRIVES BUFG \
  CONFIG.CLKOUT1_JITTER 337.616 \
  CONFIG.CLKOUT1_PHASE_ERROR 322.999 \
  CONFIG.CLKOUT1_REQUESTED_OUT_FREQ 74.25 \
  CONFIG.CLKOUT2_DRIVES BUFG \
  CONFIG.CLKOUT2_JITTER 258.703 \
  CONFIG.CLKOUT2_PHASE_ERROR 322.999 \
  CONFIG.CLKOUT2_REQUESTED_OUT_FREQ 371.25 \
  CONFIG.CLKOUT2_USED true \
  CONFIG.CLKOUT3_DRIVES BUFG \
  CONFIG.CLKOUT4_DRIVES BUFG \
  CONFIG.CLKOUT5_DRIVES BUFG \
  CONFIG.CLKOUT6_DRIVES BUFG \
  CONFIG.CLKOUT7_DRIVES BUFG \
  CONFIG.CLK_OUT1_PORT pclk \
  CONFIG.CLK_OUT2_PORT sclk \
  CONFIG.FEEDBACK_SOURCE FDBK_AUTO \
  CONFIG.MMCM_CLKFBOUT_MULT_F 37.125 \
  CONFIG.MMCM_CLKOUT0_DIVIDE_F 10.000 \
  CONFIG.MMCM_CLKOUT1_DIVIDE 2 \
  CONFIG.MMCM_COMPENSATION ZHOLD \
  CONFIG.MMCM_DIVCLK_DIVIDE 5 \
  CONFIG.NUM_OUT_CLKS 2 \
  CONFIG.PRIMITIVE MMCM \
  CONFIG.PRIM_IN_FREQ 100.000 \
  CONFIG.PRIM_SOURCE Single_ended_clock_capable_pin \
  CONFIG.USE_LOCKED true \
  CONFIG.USE_RESET false \
] [get_bd_cells clk_wiz_0]
create_bd_cell -type ip -vlnv xilinx.com:hls:pixel_unpack:1.0 pixel_unpack
create_bd_cell -type ip -vlnv digilentinc.com:ip:rgb2dvi:1.2 rgb2dvi
set_property -dict {CONFIG.kGenerateSerialClk false CONFIG.kRstActiveHigh false} [get_bd_cells rgb2dvi]
create_bd_cell -type ip -vlnv xilinx.com:ip:v_axi4s_vid_out:4.0 v_axi4s_vid_out_0
set_property -dict [list \
  CONFIG.C_ADDR_WIDTH 11 \
  CONFIG.C_HAS_ASYNC_CLK 0 \
  CONFIG.C_HYSTERESIS_LEVEL 1024 \
  CONFIG.C_S_AXIS_VIDEO_DATA_WIDTH 8 \
  CONFIG.C_S_AXIS_VIDEO_FORMAT 2 \
  CONFIG.C_VTG_MASTER_SLAVE 1 \
] [get_bd_cells v_axi4s_vid_out_0]
create_bd_cell -type ip -vlnv xilinx.com:ip:v_tc:6.1 v_tc_0
set_property -dict {CONFIG.HAS_AXI4_LITE false CONFIG.enable_detection false CONFIG.enable_generation true} [get_bd_cells v_tc_0]

# ---- connections ----

current_bd_instance /car_iop_arduino
connect_bd_intf_net [get_bd_intf_pins axi_interconnect_0/M03_AXI] [get_bd_intf_pins timer_subsystem/S_AXI_timer_0]
connect_bd_intf_net [get_bd_intf_pins AXI_Encoder_0/S_AXI] [get_bd_intf_pins axi_interconnect_0/M00_AXI]
connect_bd_intf_net [get_bd_intf_pins axi_interconnect_0/M07_AXI] [get_bd_intf_pins intr/S_AXI]
connect_bd_intf_net [get_bd_intf_pins arduino_gpio/GPIO] [get_bd_intf_pins io_switch/gpio]
connect_bd_intf_net [get_bd_intf_pins S_AXI_BRAM] [get_bd_intf_pins mb_bram_ctrl/S_AXI]
connect_bd_intf_net [get_bd_intf_pins DEBUG] [get_bd_intf_pins mb/DEBUG]
connect_bd_intf_net [get_bd_intf_pins AXI_PWM_Servo/S_AXI] [get_bd_intf_pins axi_interconnect_0/M02_AXI]
connect_bd_intf_net [get_bd_intf_pins MB_IIC] [get_bd_intf_pins axi_iic_0/IIC]
connect_bd_intf_net [get_bd_intf_pins Encoder_A0] [get_bd_intf_pins xadc_wiz_0/Vaux1]
connect_bd_intf_net [get_bd_intf_pins axi_interconnect_0/M09_AXI] [get_bd_intf_pins io_switch/S_AXI]
connect_bd_intf_net [get_bd_intf_pins axi_interconnect_0/M01_AXI] [get_bd_intf_pins motor_driver_0/S_AXI]
connect_bd_intf_net [get_bd_intf_pins mb_bram_ctrl/BRAM_PORTA] [get_bd_intf_pins microblaze_0_local_memory/BRAM_PORTB]
connect_bd_intf_net [get_bd_intf_pins mb/DLMB] [get_bd_intf_pins microblaze_0_local_memory/DLMB]
connect_bd_intf_net [get_bd_intf_pins Encoder_A1] [get_bd_intf_pins xadc_wiz_0/Vaux6]
connect_bd_intf_net [get_bd_intf_pins sig] [get_bd_intf_pins AXI_ultrasonic_ranger_0/sig]
connect_bd_intf_net [get_bd_intf_pins axi_interconnect_0/M10_AXI] [get_bd_intf_pins motor_driver_1/S_AXI]
connect_bd_intf_net [get_bd_intf_pins mb/INTERRUPT] [get_bd_intf_pins mb_intc/interrupt]
connect_bd_intf_net [get_bd_intf_pins axi_iic_0/S_AXI] [get_bd_intf_pins axi_interconnect_0/M06_AXI]
connect_bd_intf_net [get_bd_intf_pins AXI_Encoder_1/S_AXI] [get_bd_intf_pins axi_interconnect_0/M11_AXI]
connect_bd_intf_net [get_bd_intf_pins axi_interconnect_0/S00_AXI] [get_bd_intf_pins mb/M_AXI_DP]
connect_bd_intf_net [get_bd_intf_pins mb/ILMB] [get_bd_intf_pins microblaze_0_local_memory/ILMB]
connect_bd_intf_net [get_bd_intf_pins Encoder_B0] [get_bd_intf_pins xadc_wiz_0/Vaux9]
connect_bd_intf_net [get_bd_intf_pins arduino_gpio] [get_bd_intf_pins io_switch/io]
connect_bd_intf_net [get_bd_intf_pins AXI_ultrasonic_ranger_0/S_AXI] [get_bd_intf_pins axi_interconnect_0/M08_AXI]
connect_bd_intf_net [get_bd_intf_pins axi_interconnect_0/M05_AXI] [get_bd_intf_pins mb_intc/s_axi]
connect_bd_intf_net [get_bd_intf_pins Encoder_B1] [get_bd_intf_pins xadc_wiz_0/Vaux15]
connect_bd_intf_net [get_bd_intf_pins arduino_gpio/S_AXI] [get_bd_intf_pins axi_interconnect_0/M12_AXI]
connect_bd_intf_net [get_bd_intf_pins axi_interconnect_0/M04_AXI] [get_bd_intf_pins timer_subsystem/S_AXI_timer_1]
connect_bd_intf_net [get_bd_intf_pins analog2digital_0/s_axis] [get_bd_intf_pins xadc_wiz_0/M_AXIS]
connect_bd_net [get_bd_pins AXI_PWM_Servo/PWM] [get_bd_pins xlconcat_PWM/In0]
connect_bd_net [get_bd_pins SYS_Rst] [get_bd_pins microblaze_0_local_memory/SYS_Rst]
connect_bd_net [get_bd_pins analog2digital_0/A0] [get_bd_pins AXI_Encoder_0/A]
connect_bd_net [get_bd_pins analog2digital_0/A1] [get_bd_pins AXI_Encoder_1/A]
connect_bd_net [get_bd_pins analog2digital_0/B0] [get_bd_pins AXI_Encoder_0/B]
connect_bd_net [get_bd_pins analog2digital_0/B1] [get_bd_pins AXI_Encoder_1/B]
connect_bd_net [get_bd_pins aux_reset_in] [get_bd_pins proc_sys_reset/aux_reset_in]
connect_bd_net -net axi_gpio_0_gpio_io_o [get_bd_pins intr/gpio_io_o] [get_bd_pins dff_en_reset_vector_0/en]
connect_bd_net [get_bd_pins axi_iic_0/iic2intc_irpt] [get_bd_pins xlconcat_0/In1]
connect_bd_net [get_bd_pins dff_en_reset_vector_0/q] [get_bd_pins q]
connect_bd_net [get_bd_pins logic_1/dout] [get_bd_pins dff_en_reset_vector_0/d] [get_bd_pins proc_sys_reset/ext_reset_in]
connect_bd_net -net mb_debug_sys_rst_0_1 [get_bd_pins mb_debug_sys_rst] [get_bd_pins proc_sys_reset/mb_debug_sys_rst]
connect_bd_net -net microblaze_0_Clk [get_bd_pins Clk] \
  [get_bd_pins AXI_Encoder_0/s_axi_aclk] [get_bd_pins AXI_Encoder_1/s_axi_aclk] [get_bd_pins AXI_PWM_Servo/s_axi_aclk] \
  [get_bd_pins AXI_ultrasonic_ranger_0/s_axi_aclk] [get_bd_pins analog2digital_0/s_axis_aclk] \
  [get_bd_pins arduino_gpio/s_axi_aclk] [get_bd_pins axi_iic_0/s_axi_aclk] [get_bd_pins axi_interconnect_0/ACLK] \
  [get_bd_pins axi_interconnect_0/M00_ACLK] [get_bd_pins axi_interconnect_0/M01_ACLK] \
  [get_bd_pins axi_interconnect_0/M02_ACLK] [get_bd_pins axi_interconnect_0/M03_ACLK] \
  [get_bd_pins axi_interconnect_0/M04_ACLK] [get_bd_pins axi_interconnect_0/M05_ACLK] \
  [get_bd_pins axi_interconnect_0/M06_ACLK] [get_bd_pins axi_interconnect_0/M07_ACLK] \
  [get_bd_pins axi_interconnect_0/M08_ACLK] [get_bd_pins axi_interconnect_0/M09_ACLK] \
  [get_bd_pins axi_interconnect_0/M10_ACLK] [get_bd_pins axi_interconnect_0/M11_ACLK] \
  [get_bd_pins axi_interconnect_0/M12_ACLK] [get_bd_pins axi_interconnect_0/S00_ACLK] [get_bd_pins dff_en_reset_vector_0/clk] \
  [get_bd_pins intr/s_axi_aclk] [get_bd_pins io_switch/s_axi_aclk] [get_bd_pins mb/Clk] [get_bd_pins mb_bram_ctrl/s_axi_aclk] \
  [get_bd_pins mb_intc/s_axi_aclk] [get_bd_pins microblaze_0_local_memory/FCLK_CLK0] [get_bd_pins motor_driver_0/Clk] \
  [get_bd_pins motor_driver_1/Clk] [get_bd_pins proc_sys_reset/slowest_sync_clk] [get_bd_pins timer_subsystem/Clk] \
  [get_bd_pins xadc_wiz_0/m_axis_aclk] [get_bd_pins xadc_wiz_0/s_axis_aclk]
connect_bd_net [get_bd_pins motor_driver_0/out1] [get_bd_pins xlconcat_PWM/In1]
connect_bd_net [get_bd_pins motor_driver_0/out2] [get_bd_pins xlconcat_PWM/In2]
connect_bd_net [get_bd_pins motor_driver_1/out1] [get_bd_pins xlconcat_PWM/In3]
connect_bd_net [get_bd_pins motor_driver_1/out2] [get_bd_pins xlconcat_PWM/In4]
connect_bd_net -net proc_sys_reset_0_interconnect_aresetn [get_bd_pins proc_sys_reset/interconnect_aresetn] [get_bd_pins axi_interconnect_0/ARESETN]
connect_bd_net -net proc_sys_reset_0_peripheral_aresetn [get_bd_pins proc_sys_reset/peripheral_aresetn] \
  [get_bd_pins AXI_Encoder_0/s_axi_aresetn] [get_bd_pins AXI_Encoder_1/s_axi_aresetn] \
  [get_bd_pins AXI_PWM_Servo/s_axi_aresetn] [get_bd_pins AXI_ultrasonic_ranger_0/s_axi_aresetn] \
  [get_bd_pins arduino_gpio/s_axi_aresetn] [get_bd_pins axi_iic_0/s_axi_aresetn] [get_bd_pins axi_interconnect_0/M00_ARESETN] \
  [get_bd_pins axi_interconnect_0/M01_ARESETN] [get_bd_pins axi_interconnect_0/M02_ARESETN] \
  [get_bd_pins axi_interconnect_0/M03_ARESETN] [get_bd_pins axi_interconnect_0/M04_ARESETN] \
  [get_bd_pins axi_interconnect_0/M05_ARESETN] [get_bd_pins axi_interconnect_0/M06_ARESETN] \
  [get_bd_pins axi_interconnect_0/M07_ARESETN] [get_bd_pins axi_interconnect_0/M08_ARESETN] \
  [get_bd_pins axi_interconnect_0/M09_ARESETN] [get_bd_pins axi_interconnect_0/M10_ARESETN] \
  [get_bd_pins axi_interconnect_0/M11_ARESETN] [get_bd_pins axi_interconnect_0/M12_ARESETN] \
  [get_bd_pins axi_interconnect_0/S00_ARESETN] [get_bd_pins io_switch/s_axi_aresetn] [get_bd_pins mb_intc/s_axi_aresetn] \
  [get_bd_pins motor_driver_0/peripheral_aresetn] [get_bd_pins motor_driver_1/peripheral_aresetn] \
  [get_bd_pins timer_subsystem/s_axi_aresetn]
connect_bd_net [get_bd_pins proc_sys_reset/mb_reset] [get_bd_pins mb/Reset]
connect_bd_net -net reset_1 [get_bd_pins intr_ack] [get_bd_pins dff_en_reset_vector_0/reset]
connect_bd_net -net s_axi_aresetn_0_1 [get_bd_pins s_axi_bram_aresetn] \
  [get_bd_pins intr/s_axi_aresetn] [get_bd_pins mb_bram_ctrl/s_axi_aresetn] [get_bd_pins xadc_wiz_0/m_axis_resetn]
connect_bd_net [get_bd_pins timer_subsystem/timer_intr_out] [get_bd_pins xlconcat_0/In0]
connect_bd_net [get_bd_pins xlconcat_0/dout] [get_bd_pins mb_intc/intr]
connect_bd_net -net xlconcat_1_dout [get_bd_pins xlconcat_PWM/dout] [get_bd_pins io_switch/pwm_o]
set_property HDL_ATTRIBUTE.BMM_INFO_PROCESSOR {microblaze-le > design_1 car_iop_arduino/microblaze_0_local_memory/dlmb_bram_if_cntlr} [get_bd_cells mb]
set_property HDL_ATTRIBUTE.KEEP_HIERARCHY yes [get_bd_cells mb]
set_property HDL_ATTRIBUTE.BMM_INFO_ADDRESS_SPACE {byte  0x40000000 32 > design_1 car_iop_arduino/microblaze_0_local_memory/lmb_bram} [get_bd_cells mb_bram_ctrl]
set_property HDL_ATTRIBUTE.KEEP_HIERARCHY yes [get_bd_cells mb_bram_ctrl]

current_bd_instance /car_iop_arduino/microblaze_0_local_memory
connect_bd_intf_net [get_bd_intf_pins BRAM_PORTB] [get_bd_intf_pins lmb_bram/BRAM_PORTB]
connect_bd_intf_net [get_bd_intf_pins dlmb_bram_if_cntlr/SLMB1] [get_bd_intf_pins ilmb_v10/LMB_Sl_0]
connect_bd_intf_net [get_bd_intf_pins ILMB] [get_bd_intf_pins ilmb_v10/LMB_M]
connect_bd_intf_net [get_bd_intf_pins dlmb_bram_if_cntlr/BRAM_PORT] [get_bd_intf_pins lmb_bram/BRAM_PORTA]
connect_bd_intf_net [get_bd_intf_pins dlmb_bram_if_cntlr/SLMB] [get_bd_intf_pins dlmb_v10/LMB_Sl_0]
connect_bd_intf_net [get_bd_intf_pins DLMB] [get_bd_intf_pins dlmb_v10/LMB_M]
connect_bd_net [get_bd_pins SYS_Rst] [get_bd_pins dlmb_bram_if_cntlr/LMB_Rst] [get_bd_pins dlmb_v10/SYS_Rst] [get_bd_pins ilmb_v10/SYS_Rst]
connect_bd_net -net microblaze_0_Clk [get_bd_pins FCLK_CLK0] \
  [get_bd_pins dlmb_bram_if_cntlr/LMB_Clk] [get_bd_pins dlmb_v10/LMB_Clk] [get_bd_pins ilmb_v10/LMB_Clk]
set_property HDL_ATTRIBUTE.BMM_INFO_ADDRESS_SPACE {byte  0x00000000 32 > design_1 car_iop_arduino/microblaze_0_local_memory/lmb_bram} [get_bd_cells dlmb_bram_if_cntlr]
set_property HDL_ATTRIBUTE.KEEP_HIERARCHY yes [get_bd_cells dlmb_bram_if_cntlr]

current_bd_instance /car_iop_arduino/motor_driver_0
connect_bd_intf_net [get_bd_intf_pins axi_interconnect/M01_AXI] [get_bd_intf_pins axi_motor_ctrl_sel_0/S_AXI]
connect_bd_intf_net [get_bd_intf_pins AXI_PWM_Motor/S_AXI] [get_bd_intf_pins axi_interconnect/M00_AXI]
connect_bd_intf_net [get_bd_intf_pins S_AXI] [get_bd_intf_pins axi_interconnect/S00_AXI]
connect_bd_net [get_bd_pins AXI_PWM_Motor/PWM] [get_bd_pins axi_motor_ctrl_sel_0/PWM]
connect_bd_net [get_bd_pins AXI_PWM_Motor/dir] [get_bd_pins axi_motor_ctrl_sel_0/dir]
connect_bd_net [get_bd_pins Clk] \
  [get_bd_pins AXI_PWM_Motor/s_axi_aclk] [get_bd_pins axi_interconnect/ACLK] [get_bd_pins axi_interconnect/M00_ACLK] \
  [get_bd_pins axi_interconnect/M01_ACLK] [get_bd_pins axi_interconnect/S00_ACLK] \
  [get_bd_pins axi_motor_ctrl_sel_0/s_axi_aclk]
connect_bd_net [get_bd_pins axi_motor_ctrl_sel_0/out1] [get_bd_pins out1]
connect_bd_net [get_bd_pins axi_motor_ctrl_sel_0/out2] [get_bd_pins out2]
connect_bd_net [get_bd_pins peripheral_aresetn] \
  [get_bd_pins AXI_PWM_Motor/s_axi_aresetn] [get_bd_pins axi_interconnect/ARESETN] [get_bd_pins axi_interconnect/M00_ARESETN] \
  [get_bd_pins axi_interconnect/M01_ARESETN] [get_bd_pins axi_interconnect/S00_ARESETN] \
  [get_bd_pins axi_motor_ctrl_sel_0/s_axi_aresetn]

current_bd_instance /car_iop_arduino/motor_driver_1
connect_bd_intf_net [get_bd_intf_pins S_AXI] [get_bd_intf_pins axi_interconnect/S00_AXI]
connect_bd_intf_net [get_bd_intf_pins axi_interconnect/M01_AXI] [get_bd_intf_pins axi_motor_ctrl_sel_0/S_AXI]
connect_bd_intf_net [get_bd_intf_pins AXI_PWM_Motor/S_AXI] [get_bd_intf_pins axi_interconnect/M00_AXI]
connect_bd_net [get_bd_pins AXI_PWM_Motor/PWM] [get_bd_pins axi_motor_ctrl_sel_0/PWM]
connect_bd_net [get_bd_pins AXI_PWM_Motor/dir] [get_bd_pins axi_motor_ctrl_sel_0/dir]
connect_bd_net [get_bd_pins Clk] \
  [get_bd_pins AXI_PWM_Motor/s_axi_aclk] [get_bd_pins axi_interconnect/ACLK] [get_bd_pins axi_interconnect/M00_ACLK] \
  [get_bd_pins axi_interconnect/M01_ACLK] [get_bd_pins axi_interconnect/S00_ACLK] \
  [get_bd_pins axi_motor_ctrl_sel_0/s_axi_aclk]
connect_bd_net [get_bd_pins axi_motor_ctrl_sel_0/out1] [get_bd_pins out1]
connect_bd_net [get_bd_pins axi_motor_ctrl_sel_0/out2] [get_bd_pins out2]
connect_bd_net [get_bd_pins peripheral_aresetn] \
  [get_bd_pins AXI_PWM_Motor/s_axi_aresetn] [get_bd_pins axi_interconnect/ARESETN] [get_bd_pins axi_interconnect/M00_ARESETN] \
  [get_bd_pins axi_interconnect/M01_ARESETN] [get_bd_pins axi_interconnect/S00_ARESETN] \
  [get_bd_pins axi_motor_ctrl_sel_0/s_axi_aresetn]

current_bd_instance /car_iop_arduino/timer_subsystem
connect_bd_intf_net [get_bd_intf_pins S_AXI_timer_1] [get_bd_intf_pins timer_1/S_AXI]
connect_bd_intf_net [get_bd_intf_pins S_AXI_timer_0] [get_bd_intf_pins timer_0/S_AXI]
connect_bd_net [get_bd_pins Clk] [get_bd_pins timer_0/s_axi_aclk] [get_bd_pins timer_1/s_axi_aclk]
connect_bd_net [get_bd_pins s_axi_aresetn] [get_bd_pins timer_0/s_axi_aresetn] [get_bd_pins timer_1/s_axi_aresetn]
connect_bd_net -net axi_timer_0_interrupt [get_bd_pins timer_0/interrupt] [get_bd_pins timer_intr/In0]
connect_bd_net [get_bd_pins timer_1/interrupt] [get_bd_pins timer_intr/In1]
connect_bd_net [get_bd_pins timer_intr/dout] [get_bd_pins timer_intr_out]

current_bd_instance /image_processing
connect_bd_intf_net [get_bd_intf_pins Canny_accel_0/out_strm] [get_bd_intf_pins axis_subset_converter_3/S_AXIS]
connect_bd_intf_net [get_bd_intf_pins M_AXI_MM2S] [get_bd_intf_pins axi_dma_proc/M_AXI_MM2S]
connect_bd_intf_net [get_bd_intf_pins axi_interconnect_0/M05_AXI] [get_bd_intf_pins pixel_unpack/s_axi_AXILiteS]
connect_bd_intf_net [get_bd_intf_pins S00_AXI] [get_bd_intf_pins axi_interconnect_0/S00_AXI]
connect_bd_intf_net [get_bd_intf_pins axis_interconnect_back/S03_AXIS] [get_bd_intf_pins axis_subset_converter_5/M_AXIS]
connect_bd_intf_net [get_bd_intf_pins Canny_accel_0/s_axi_AXILiteS] [get_bd_intf_pins axi_interconnect_0/M03_AXI]
connect_bd_intf_net [get_bd_intf_pins axi_interconnect_0/M01_AXI] [get_bd_intf_pins axis_interconnect_front/S_AXI_CTRL]
connect_bd_intf_net [get_bd_intf_pins SobelY_accel_0/out_stream] [get_bd_intf_pins axis_subset_converter_5/S_AXIS]
connect_bd_intf_net [get_bd_intf_pins SobelX_accel_0/out_stream] [get_bd_intf_pins axis_subset_converter_1/S_AXIS]
connect_bd_intf_net [get_bd_intf_pins Canny_accel_0/in_strm] [get_bd_intf_pins axis_subset_converter_0/M_AXIS]
connect_bd_intf_net [get_bd_intf_pins axi_dma_proc/S_AXI_LITE] [get_bd_intf_pins axi_interconnect_0/M00_AXI]
connect_bd_intf_net [get_bd_intf_pins axi_dma_proc/S_AXIS_S2MM] [get_bd_intf_pins pixel_pack/stream_out_32]
connect_bd_intf_net [get_bd_intf_pins axis_interconnect_back/S00_AXIS] [get_bd_intf_pins axis_interconnect_front/M00_AXIS]
connect_bd_intf_net [get_bd_intf_pins axis_interconnect_front/M03_AXIS] [get_bd_intf_pins axis_subset_converter_4/S_AXIS]
connect_bd_intf_net [get_bd_intf_pins SobelY_accel_0/in_stream] [get_bd_intf_pins axis_subset_converter_4/M_AXIS]
connect_bd_intf_net [get_bd_intf_pins axis_interconnect_back/S02_AXIS] [get_bd_intf_pins axis_subset_converter_1/M_AXIS]
connect_bd_intf_net [get_bd_intf_pins axi_interconnect_0/M02_AXI] [get_bd_intf_pins axis_interconnect_back/S_AXI_CTRL]
connect_bd_intf_net [get_bd_intf_pins axis_interconnect_back/S01_AXIS] [get_bd_intf_pins axis_subset_converter_3/M_AXIS]
connect_bd_intf_net [get_bd_intf_pins SobelX_accel_0/in_stream] [get_bd_intf_pins axis_subset_converter_2/M_AXIS]
connect_bd_intf_net [get_bd_intf_pins axis_interconnect_back/M00_AXIS] [get_bd_intf_pins pixel_pack/stream_in_24]
connect_bd_intf_net [get_bd_intf_pins axis_interconnect_front/S00_AXIS] [get_bd_intf_pins pixel_unpack/stream_out_24]
connect_bd_intf_net [get_bd_intf_pins axis_interconnect_front/M04_AXIS] [get_bd_intf_pins color_detect/strm_in]
connect_bd_intf_net [get_bd_intf_pins axi_interconnect_0/M06_AXI] [get_bd_intf_pins pixel_pack/s_axi_AXILiteS]
connect_bd_intf_net [get_bd_intf_pins axis_interconnect_front/M02_AXIS] [get_bd_intf_pins axis_subset_converter_2/S_AXIS]
connect_bd_intf_net [get_bd_intf_pins axi_interconnect_0/M04_AXI] [get_bd_intf_pins color_detect/s_axi_AXILiteS]
connect_bd_intf_net [get_bd_intf_pins axis_interconnect_front/M01_AXIS] [get_bd_intf_pins axis_subset_converter_0/S_AXIS]
connect_bd_intf_net [get_bd_intf_pins axi_dma_proc/M_AXIS_MM2S] [get_bd_intf_pins pixel_unpack/stream_in_32]
connect_bd_intf_net [get_bd_intf_pins M_AXI_S2MM] [get_bd_intf_pins axi_dma_proc/M_AXI_S2MM]
connect_bd_net [get_bd_pins M04_ARESETN] \
  [get_bd_pins axi_interconnect_0/M04_ARESETN] [get_bd_pins axi_interconnect_0/M05_ARESETN] \
  [get_bd_pins axi_interconnect_0/M06_ARESETN] [get_bd_pins axis_interconnect_front/M04_AXIS_ARESETN] \
  [get_bd_pins color_detect/ap_rst_n] [get_bd_pins pixel_pack/ap_rst_n] [get_bd_pins pixel_pack/ap_rst_n_control] \
  [get_bd_pins pixel_unpack/ap_rst_n] [get_bd_pins pixel_unpack/ap_rst_n_control]
connect_bd_net [get_bd_pins ap_clk] \
  [get_bd_pins Canny_accel_0/ap_clk] [get_bd_pins SobelX_accel_0/ap_clk] [get_bd_pins SobelY_accel_0/ap_clk] \
  [get_bd_pins axi_dma_proc/m_axi_mm2s_aclk] [get_bd_pins axi_dma_proc/m_axi_s2mm_aclk] \
  [get_bd_pins axi_dma_proc/s_axi_lite_aclk] [get_bd_pins axi_interconnect_0/ACLK] [get_bd_pins axi_interconnect_0/M00_ACLK] \
  [get_bd_pins axi_interconnect_0/M01_ACLK] [get_bd_pins axi_interconnect_0/M02_ACLK] \
  [get_bd_pins axi_interconnect_0/M03_ACLK] [get_bd_pins axi_interconnect_0/M04_ACLK] \
  [get_bd_pins axi_interconnect_0/M05_ACLK] [get_bd_pins axi_interconnect_0/M06_ACLK] \
  [get_bd_pins axi_interconnect_0/S00_ACLK] [get_bd_pins axis_interconnect_back/ACLK] \
  [get_bd_pins axis_interconnect_back/M00_AXIS_ACLK] [get_bd_pins axis_interconnect_back/S00_AXIS_ACLK] \
  [get_bd_pins axis_interconnect_back/S01_AXIS_ACLK] [get_bd_pins axis_interconnect_back/S02_AXIS_ACLK] \
  [get_bd_pins axis_interconnect_back/S03_AXIS_ACLK] [get_bd_pins axis_interconnect_back/S_AXI_CTRL_ACLK] \
  [get_bd_pins axis_interconnect_front/ACLK] [get_bd_pins axis_interconnect_front/M00_AXIS_ACLK] \
  [get_bd_pins axis_interconnect_front/M01_AXIS_ACLK] [get_bd_pins axis_interconnect_front/M02_AXIS_ACLK] \
  [get_bd_pins axis_interconnect_front/M03_AXIS_ACLK] [get_bd_pins axis_interconnect_front/M04_AXIS_ACLK] \
  [get_bd_pins axis_interconnect_front/S00_AXIS_ACLK] [get_bd_pins axis_interconnect_front/S_AXI_CTRL_ACLK] \
  [get_bd_pins axis_subset_converter_0/aclk] [get_bd_pins axis_subset_converter_1/aclk] \
  [get_bd_pins axis_subset_converter_2/aclk] [get_bd_pins axis_subset_converter_3/aclk] \
  [get_bd_pins axis_subset_converter_4/aclk] [get_bd_pins axis_subset_converter_5/aclk] [get_bd_pins color_detect/ap_clk] \
  [get_bd_pins pixel_pack/ap_clk] [get_bd_pins pixel_pack/control] [get_bd_pins pixel_unpack/ap_clk] \
  [get_bd_pins pixel_unpack/control] [get_bd_pins proc_sys_reset_0/slowest_sync_clk]
connect_bd_net [get_bd_pins aux_reset_in] [get_bd_pins proc_sys_reset_0/aux_reset_in]
connect_bd_net -net axi_dma_0_mm2s_introut [get_bd_pins axi_dma_proc/mm2s_introut] [get_bd_pins mm2s_introut]
connect_bd_net -net axi_dma_0_s2mm_introut [get_bd_pins axi_dma_proc/s2mm_introut] [get_bd_pins s2mm_introut]
connect_bd_net [get_bd_pins logic_1/dout] [get_bd_pins proc_sys_reset_0/ext_reset_in]
connect_bd_net [get_bd_pins proc_sys_reset_0/interconnect_aresetn] \
  [get_bd_pins axi_interconnect_0/ARESETN] [get_bd_pins axis_interconnect_back/ARESETN] \
  [get_bd_pins axis_interconnect_front/ARESETN]
connect_bd_net [get_bd_pins proc_sys_reset_0/peripheral_aresetn] \
  [get_bd_pins Canny_accel_0/ap_rst_n] [get_bd_pins SobelX_accel_0/ap_rst_n] [get_bd_pins SobelY_accel_0/ap_rst_n] \
  [get_bd_pins axi_dma_proc/axi_resetn] [get_bd_pins axi_interconnect_0/M00_ARESETN] \
  [get_bd_pins axi_interconnect_0/M01_ARESETN] [get_bd_pins axi_interconnect_0/M02_ARESETN] \
  [get_bd_pins axi_interconnect_0/M03_ARESETN] [get_bd_pins axi_interconnect_0/S00_ARESETN] \
  [get_bd_pins axis_interconnect_back/M00_AXIS_ARESETN] [get_bd_pins axis_interconnect_back/S00_AXIS_ARESETN] \
  [get_bd_pins axis_interconnect_back/S01_AXIS_ARESETN] [get_bd_pins axis_interconnect_back/S02_AXIS_ARESETN] \
  [get_bd_pins axis_interconnect_back/S03_AXIS_ARESETN] [get_bd_pins axis_interconnect_back/S_AXI_CTRL_ARESETN] \
  [get_bd_pins axis_interconnect_front/M00_AXIS_ARESETN] [get_bd_pins axis_interconnect_front/M01_AXIS_ARESETN] \
  [get_bd_pins axis_interconnect_front/M02_AXIS_ARESETN] [get_bd_pins axis_interconnect_front/M03_AXIS_ARESETN] \
  [get_bd_pins axis_interconnect_front/S00_AXIS_ARESETN] [get_bd_pins axis_interconnect_front/S_AXI_CTRL_ARESETN] \
  [get_bd_pins axis_subset_converter_0/aresetn] [get_bd_pins axis_subset_converter_1/aresetn] \
  [get_bd_pins axis_subset_converter_2/aresetn] [get_bd_pins axis_subset_converter_3/aresetn] \
  [get_bd_pins axis_subset_converter_4/aresetn] [get_bd_pins axis_subset_converter_5/aresetn]
connect_bd_net [get_bd_pins xlconstant_0/dout] \
  [get_bd_pins axis_interconnect_back/S00_ARB_REQ_SUPPRESS] [get_bd_pins axis_interconnect_back/S01_ARB_REQ_SUPPRESS] \
  [get_bd_pins axis_interconnect_back/S02_ARB_REQ_SUPPRESS] [get_bd_pins axis_interconnect_back/S03_ARB_REQ_SUPPRESS]
